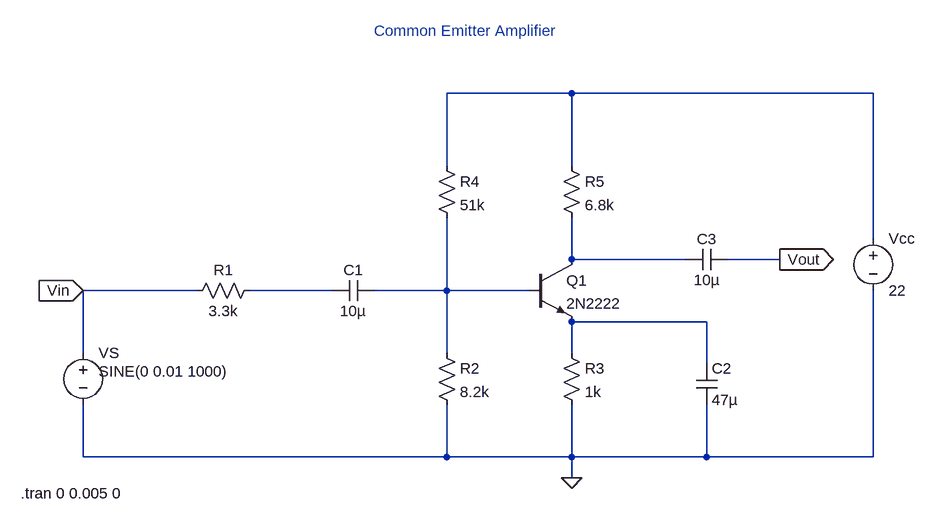
[diagram p0: schematic 2EEB_VELASCO_EXPT7_CKT2.asc]
2EEB_VELASCO_EXPT7_CKT2.asc, the LTspice schematic file:
Version 4
SHEET 1 1368 680
WIRE 816 -224 624 -224
WIRE 1280 -224 816 -224
WIRE 624 -112 624 -224
WIRE 816 -112 816 -224
WIRE 1280 0 1280 -224
WIRE 816 32 816 -32
WIRE 992 32 816 32
WIRE 1136 32 1056 32
WIRE 240 80 64 80
WIRE 448 80 320 80
WIRE 624 80 624 -32
WIRE 624 80 512 80
WIRE 752 80 624 80
WIRE 1024 128 816 128
WIRE 64 176 64 80
WIRE 624 176 624 80
WIRE 816 176 816 128
WIRE 1024 192 1024 128
WIRE 64 336 64 256
WIRE 624 336 624 256
WIRE 624 336 64 336
WIRE 816 336 816 256
WIRE 816 336 624 336
WIRE 1024 336 1024 256
WIRE 1024 336 816 336
WIRE 1280 336 1280 80
WIRE 1280 336 1024 336
WIRE 816 368 816 336
FLAG 1136 32 Vout
IOPIN 1136 32 Out
FLAG 64 80 Vin
IOPIN 64 80 In
FLAG 816 368 0
SYMBOL voltage 64 160 R0
WINDOW 3 24 44 Left 2
WINDOW 123 0 0 Left 0
WINDOW 39 0 0 Left 0
SYMATTR Value SINE(0 0.01 1000)
SYMATTR InstName VS
SYMBOL res 336 64 R90
WINDOW 0 0 56 VBottom 2
WINDOW 3 32 56 VTop 2
SYMATTR InstName R1
SYMATTR Value 3.3k
SYMBOL cap 512 64 R90
WINDOW 0 0 32 VBottom 2
WINDOW 3 32 32 VTop 2
SYMATTR InstName C1
SYMATTR Value 10µ
SYMBOL res 608 160 R0
SYMATTR InstName R2
SYMATTR Value 8.2k
SYMBOL res 608 -128 R0
SYMATTR InstName R4
SYMATTR Value 51k
SYMBOL npn 752 32 R0
SYMATTR InstName Q1
SYMATTR Value 2N2222
SYMBOL res 800 160 R0
SYMATTR InstName R3
SYMATTR Value 1k
SYMBOL cap 1008 192 R0
SYMATTR InstName C2
SYMATTR Value 47µ
SYMBOL res 800 -128 R0
SYMATTR InstName R5
SYMATTR Value 6.8k
SYMBOL cap 1056 16 R90
WINDOW 0 0 32 VBottom 2
WINDOW 3 32 32 VTop 2
SYMATTR InstName C3
SYMATTR Value 10µ
SYMBOL voltage 1280 -16 R0
SYMATTR InstName Vcc
SYMATTR Value 22
TEXT -32 392 Left 2 !.tran 0 0.005 0
TEXT 512 -320 Left 2 ;Common Emitter Amplifier

The netlist it stands for:
* 2EEB_VELASCO_EXPT7_CKT2.asc
VS Vin 0 SINE(0 0.01 1000)
R1 N003 Vin 3.3k
C1 N004 N003 10µ
R2 N004 0 8.2k
R4 N001 N004 51k
Q1 N002 N004 N005 0 2N2222
R3 N005 0 1k
C2 N005 0 47µ
R5 N001 N002 6.8k
C3 Vout N002 10µ
Vcc N001 0 22
.model NPN NPN
.model PNP PNP
.lib standard.bjt
.tran 0 0.005 0
* Common Emitter Amplifier
.backanno
.end